# Altium schematic sheet LaserControlBoard.SchDoc
size A3; DocumentNumber: 1; SheetNumber: 1; SheetTotal: 10
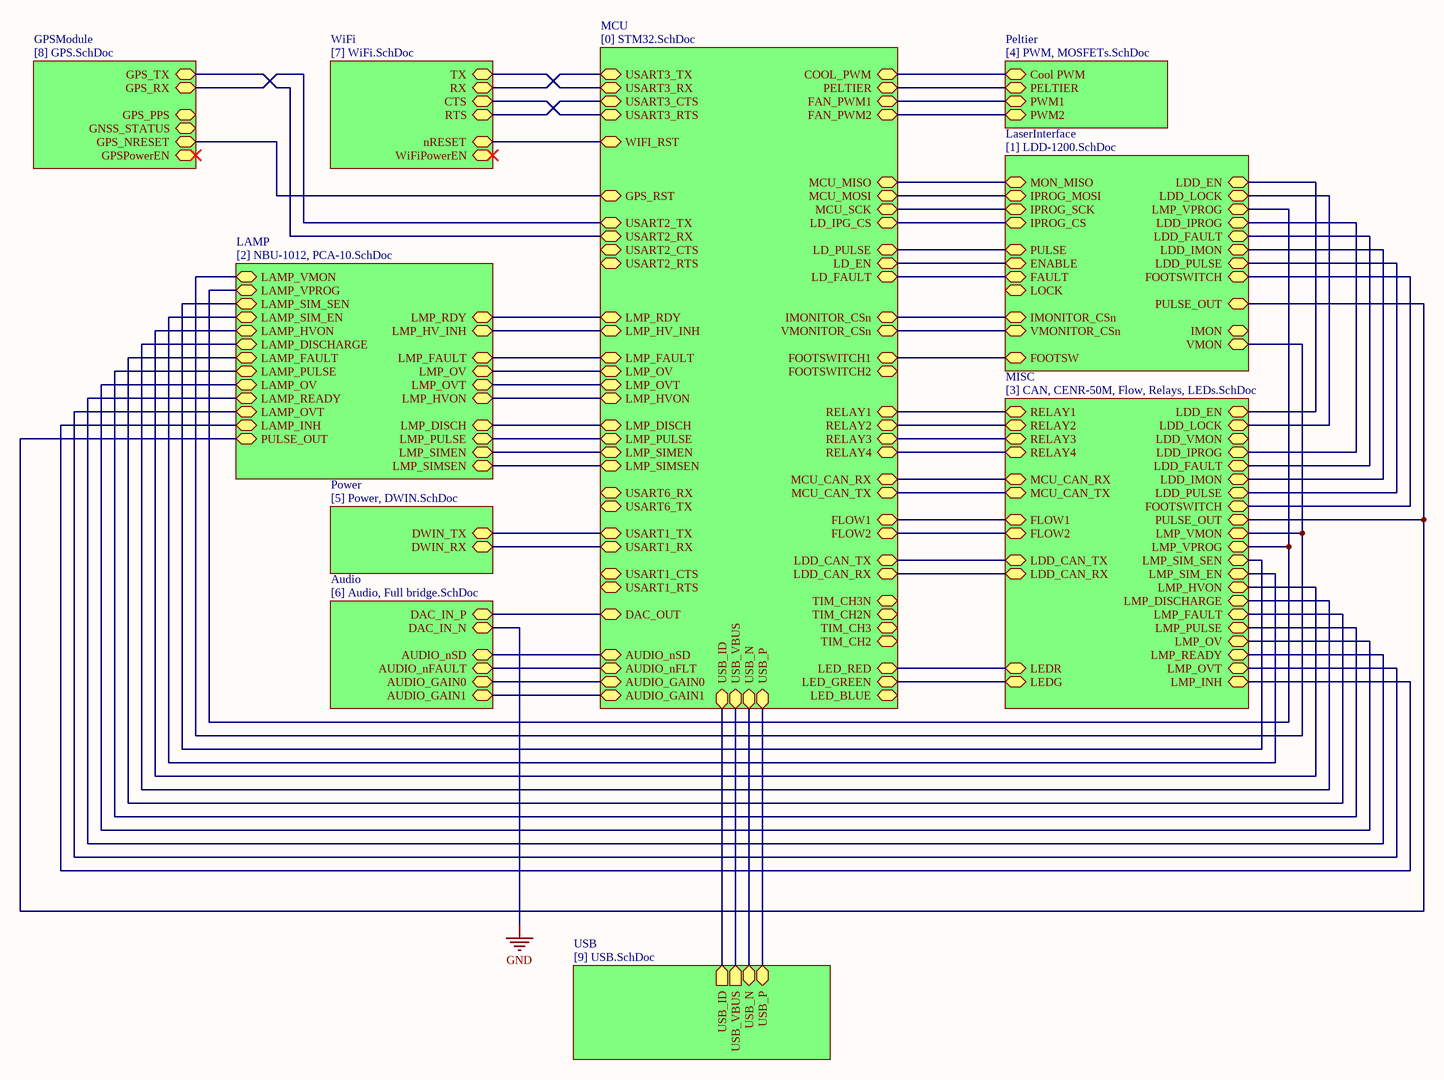
[diagram p0: LaserControlBoard.SchDoc]

## Sub-sheets
Audio = [6] Audio, Full bridge.SchDoc: AUDIO_GAIN0, AUDIO_nSD, AUDIO_nFAULT, DAC_IN_N, AUDIO_GAIN1, DAC_IN_P
GPSModule = [8] GPS.SchDoc: GNSS_STATUS, GPS_TX, GPS_PPS, GPSPowerEN, GPS_NRESET, GPS_RX
LAMP = [2] NBU-1012, PCA-10.SchDoc: LMP_SIMSEN, LMP_RDY, LMP_SIMEN, LMP_DISCH, LMP_HV_INH, LMP_FAULT, LMP_OV, LMP_OVT, LMP_HVON, LMP_PULSE, LAMP_VMON, LAMP_VPROG, LAMP_SIM_SEN, LAMP_SIM_EN, LAMP_HVON, LAMP_DISCHARGE, LAMP_FAULT, LAMP_PULSE, LAMP_OV, LAMP_READY, LAMP_OVT, LAMP_INH, PULSE_OUT
LaserInterface = [1] LDD-1200.SchDoc: IPROG_MOSI, IPROG_SCK, IPROG_CS, LOCK, FAULT, ENABLE, PULSE, MON_MISO, IMONITOR_CSn, VMONITOR_CSn, FOOTSW, VMON, LDD_EN, LDD_LOCK, LDD_IPROG, LDD_FAULT, LDD_IMON, LDD_PULSE, FOOTSWITCH, PULSE_OUT, LMP_VPROG, IMON
MCU = [0] STM32.SchDoc: MCU_SCK, MCU_MISO, MCU_MOSI, USART2_CTS, USART2_RTS, USART2_TX, USART2_RX, USART3_TX, USART3_RX, USART3_CTS, USART3_RTS, LD_PULSE, LD_EN, LD_FAULT, LD_IPG_CS, COOL_PWM, PELTIER, RELAY1, FAN_PWM1, FAN_PWM2, IMONITOR_CSn, VMONITOR_CSn, RELAY2, RELAY3, RELAY4, FOOTSWITCH1, LED_RED, LMP_SIMSEN, LMP_RDY, LMP_SIMEN, LMP_DISCH, LMP_PULSE, LMP_HV_INH, LMP_FAULT, LMP_OV, LMP_OVT, LMP_HVON, FOOTSWITCH2, FLOW2, FLOW1, LED_GREEN, LED_BLUE, USART6_TX, USART6_RX, USART1_CTS, USART1_RTS, USART1_TX, USART1_RX, WIFI_RST, TIM_CH3, TIM_CH2, TIM_CH2N, TIM_CH3N, MCU_CAN_RX, MCU_CAN_TX, GPS_RST, LDD_CAN_TX, LDD_CAN_RX, DAC_OUT, AUDIO_nSD, AUDIO_GAIN0, AUDIO_GAIN1, AUDIO_nFLT, USB_ID, USB_VBUS, USB_N, USB_P
MISC = [3] CAN, CENR-50M, Flow, Relays, LEDs.SchDoc: RELAY1, RELAY2, RELAY3, RELAY4, FLOW1, FLOW2, LEDR, LEDG, LMP_VMON, LMP_VPROG, LMP_SIM_SEN, LMP_SIM_EN, LMP_HVON, LMP_DISCHARGE, LMP_FAULT, LMP_PULSE, LMP_OV, LMP_READY, LMP_OVT, LMP_INH, LDD_EN, LDD_LOCK, LDD_VMON, LDD_IPROG, LDD_FAULT, LDD_IMON, LDD_PULSE, FOOTSWITCH, PULSE_OUT, MCU_CAN_RX, MCU_CAN_TX, LDD_CAN_RX, LDD_CAN_TX
Peltier = [4] PWM, MOSFETs.SchDoc: Cool PWM, PWM1, PWM2, PELTIER
Power = [5] Power, DWIN.SchDoc: DWIN_TX, DWIN_RX
USB = [9] USB.SchDoc: USB_N (bidir), USB_P (bidir), USB_VBUS (out), USB_ID (out)
WiFi = [7] WiFi.SchDoc: nRESET, RX, TX, CTS, RTS, WiFiPowerEN

## Nets
GND: sheet Audio/DAC_IN_N
(unnamed): sheet MCU/MCU_SCK, sheet LaserInterface/IPROG_SCK
(unnamed): sheet MCU/MCU_MISO, sheet LaserInterface/MON_MISO
(unnamed): sheet MCU/MCU_MOSI, sheet LaserInterface/IPROG_MOSI
(unnamed): sheet MCU/USART2_TX, sheet GPSModule/GPS_RX
(unnamed): sheet MCU/USART2_RX, sheet GPSModule/GPS_TX
(unnamed): sheet MCU/USART3_TX, sheet WiFi/RX
(unnamed): sheet MCU/USART3_RX, sheet WiFi/TX
(unnamed): sheet MCU/USART3_CTS, sheet WiFi/RTS
(unnamed): sheet MCU/USART3_RTS, sheet WiFi/CTS
(unnamed): sheet MCU/LD_PULSE, sheet LaserInterface/PULSE
(unnamed): sheet MCU/LD_EN, sheet LaserInterface/ENABLE
(unnamed): sheet MCU/LD_FAULT, sheet LaserInterface/FAULT
(unnamed): sheet MCU/LD_IPG_CS, sheet LaserInterface/IPROG_CS
(unnamed): sheet MCU/COOL_PWM, sheet Peltier/Cool PWM
(unnamed): sheet MCU/PELTIER, sheet Peltier/PELTIER
(unnamed): sheet MCU/RELAY1, sheet MISC/RELAY1
(unnamed): sheet MCU/FAN_PWM1, sheet Peltier/PWM1
(unnamed): sheet MCU/FAN_PWM2, sheet Peltier/PWM2
(unnamed): sheet MCU/IMONITOR_CSn, sheet LaserInterface/IMONITOR_CSn
(unnamed): sheet MCU/VMONITOR_CSn, sheet LaserInterface/VMONITOR_CSn
(unnamed): sheet MCU/RELAY2, sheet MISC/RELAY2
(unnamed): sheet MCU/RELAY3, sheet MISC/RELAY3
(unnamed): sheet MCU/RELAY4, sheet MISC/RELAY4
(unnamed): sheet MCU/FOOTSWITCH1, sheet LaserInterface/FOOTSW
(unnamed): sheet MCU/LED_RED, sheet MISC/LEDR
(unnamed): sheet MCU/LMP_SIMSEN, sheet LAMP/LMP_SIMSEN
(unnamed): sheet MCU/LMP_RDY, sheet LAMP/LMP_RDY
(unnamed): sheet MCU/LMP_SIMEN, sheet LAMP/LMP_SIMEN
(unnamed): sheet MCU/LMP_DISCH, sheet LAMP/LMP_DISCH
(unnamed): sheet MCU/LMP_PULSE, sheet LAMP/LMP_PULSE
(unnamed): sheet MCU/LMP_HV_INH, sheet LAMP/LMP_HV_INH
(unnamed): sheet MCU/LMP_FAULT, sheet LAMP/LMP_FAULT
(unnamed): sheet MCU/LMP_OV, sheet LAMP/LMP_OV
(unnamed): sheet MCU/LMP_OVT, sheet LAMP/LMP_OVT
(unnamed): sheet MCU/LMP_HVON, sheet LAMP/LMP_HVON
(unnamed): sheet MCU/FLOW2, sheet MISC/FLOW2
(unnamed): sheet MCU/FLOW1, sheet MISC/FLOW1
(unnamed): sheet MCU/LED_GREEN, sheet MISC/LEDG
(unnamed): sheet MCU/USART1_TX, sheet Power/DWIN_TX
(unnamed): sheet MCU/USART1_RX, sheet Power/DWIN_RX
(unnamed): sheet MCU/WIFI_RST, sheet WiFi/nRESET
(unnamed): sheet MCU/MCU_CAN_RX, sheet MISC/MCU_CAN_RX
(unnamed): sheet MCU/MCU_CAN_TX, sheet MISC/MCU_CAN_TX
(unnamed): sheet MCU/GPS_RST, sheet GPSModule/GPS_NRESET
(unnamed): sheet MCU/LDD_CAN_TX, sheet MISC/LDD_CAN_TX
(unnamed): sheet MCU/LDD_CAN_RX, sheet MISC/LDD_CAN_RX
(unnamed): sheet MCU/DAC_OUT, sheet Audio/DAC_IN_P
(unnamed): sheet MCU/AUDIO_nSD, sheet Audio/AUDIO_nSD
(unnamed): sheet MCU/AUDIO_GAIN0, sheet Audio/AUDIO_GAIN0
(unnamed): sheet MCU/AUDIO_GAIN1, sheet Audio/AUDIO_GAIN1
(unnamed): sheet MCU/AUDIO_nFLT, sheet Audio/AUDIO_nFAULT
(unnamed): sheet MCU/USB_ID, sheet USB/USB_ID
(unnamed): sheet MCU/USB_VBUS, sheet USB/USB_VBUS
(unnamed): sheet MCU/USB_N, sheet USB/USB_N
(unnamed): sheet MCU/USB_P, sheet USB/USB_P
(unnamed): sheet LaserInterface/VMON, sheet MISC/LMP_VMON, sheet LAMP/LAMP_VMON
(unnamed): sheet LaserInterface/LDD_EN, sheet MISC/LDD_EN
(unnamed): sheet LaserInterface/LDD_LOCK, sheet MISC/LDD_LOCK
(unnamed): sheet LaserInterface/LDD_IPROG, sheet MISC/LDD_IPROG
(unnamed): sheet LaserInterface/LDD_FAULT, sheet MISC/LDD_FAULT
(unnamed): sheet LaserInterface/LDD_IMON, sheet MISC/LDD_IMON
(unnamed): sheet LaserInterface/LDD_PULSE, sheet MISC/LDD_PULSE
(unnamed): sheet LaserInterface/FOOTSWITCH, sheet MISC/FOOTSWITCH
(unnamed): sheet LaserInterface/PULSE_OUT, sheet MISC/PULSE_OUT, sheet LAMP/PULSE_OUT
(unnamed): sheet LaserInterface/LMP_VPROG, sheet MISC/LMP_VPROG, sheet LAMP/LAMP_VPROG
(unnamed): sheet MISC/LMP_SIM_SEN, sheet LAMP/LAMP_SIM_SEN
(unnamed): sheet MISC/LMP_SIM_EN, sheet LAMP/LAMP_SIM_EN
(unnamed): sheet MISC/LMP_HVON, sheet LAMP/LAMP_HVON
(unnamed): sheet MISC/LMP_DISCHARGE, sheet LAMP/LAMP_DISCHARGE
(unnamed): sheet MISC/LMP_FAULT, sheet LAMP/LAMP_FAULT
(unnamed): sheet MISC/LMP_PULSE, sheet LAMP/LAMP_PULSE
(unnamed): sheet MISC/LMP_OV, sheet LAMP/LAMP_OV
(unnamed): sheet MISC/LMP_READY, sheet LAMP/LAMP_READY
(unnamed): sheet MISC/LMP_OVT, sheet LAMP/LAMP_OVT
(unnamed): sheet MISC/LMP_INH, sheet LAMP/LAMP_INH